# EAGLE schematic bilancia_smart_pezzi_uc (EAGLE 7.3.0)
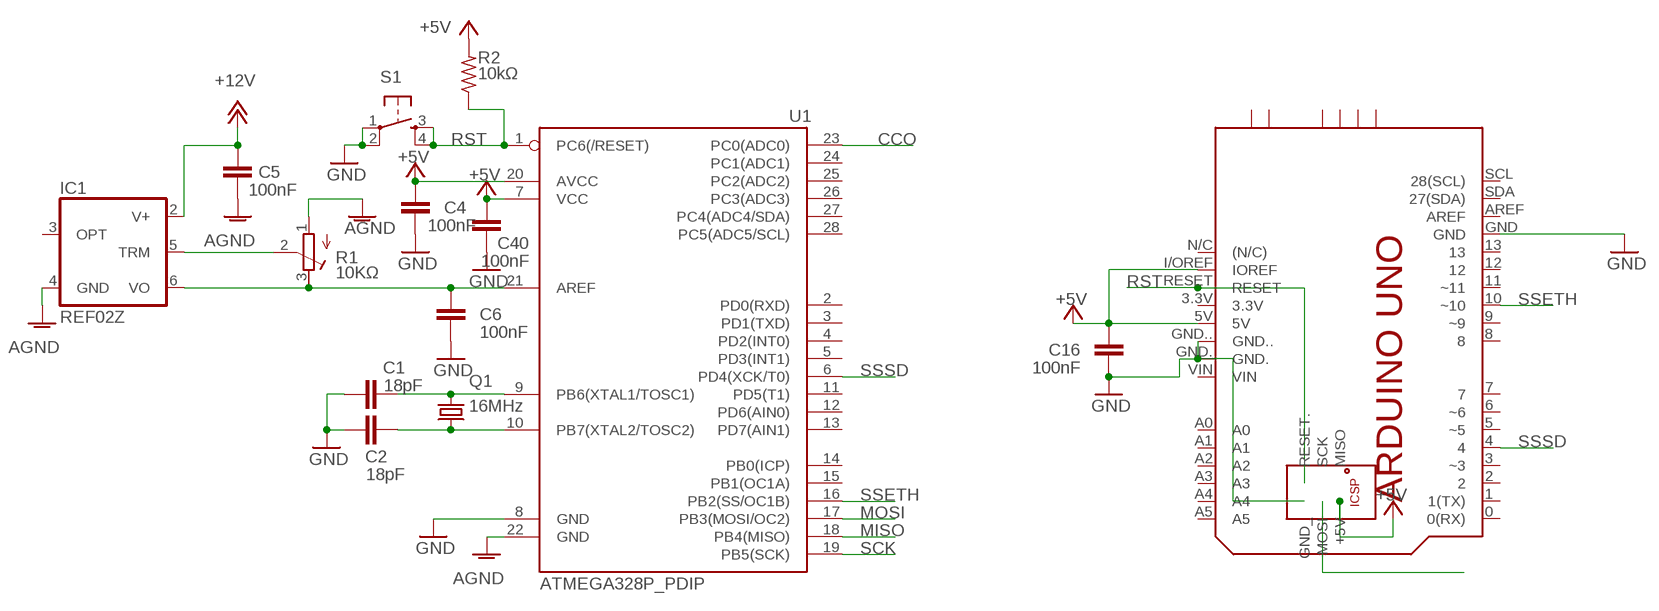
[diagram p0: schematic, sheet 1]

## Parts
C1  18pF  C2.5/2  [C2.5-2]
C2  18pF  C2.5/2  [C2.5-2]
C4  100nF  C2.5/2  [C2.5-2]
C5  100nF  C2.5/2  [C2.5-2]
C6  100nF  C2.5/2  [C2.5-2]
C16  100nF  C2.5/2  [C2.5-2]
C40  100nF  C2.5/2  [C2.5-2]
IC1  REF02Z  [DIL08]
PCB1  ARDUINO_UNO  [ARDUINO_UNO]
Q1  16MHz  CRYSTALHC49S  [HC49/S]
R1  10KΩ  R-TRIMM64W  [RTRIM64W]
R2  10kΩ  R-US_0207/10  [0207/10]
S1  TAC_SWITCHPTH  [TACTILE-PTH]
U1  ATMEGA328P_PDIP  [DIL28-3]

## Nets
+5V [massa]: C4.2 C16.2 C40.2 PCB1.5V PCB1.+5V PCB1.I/OREF(IOREF) R2.2 U1.7(VCC) U1.20(AVCC)
+12V [massa]: C5.1 IC1.2(V+)
AGND [massa]: C5.2 IC1.4(GND) R1.1(E) U1.22(GND)
CCO: U1.23(PC0(ADC0))
GND [massa]: C1.1 C2.1 C4.1 C6.1 C16.1 C40.1 PCB1.GND PCB1.GND. PCB1.GND.. PCB1.GND_ S1.1 S1.2 U1.8(GND)
MISO: U1.18(PB4(MISO))
MOSI: PCB1.MOSI U1.17(PB3(MOSI/OC2))
N$1: C6.2 IC1.6(VO) R1.3(A) U1.21(AREF)
N$2: C2.2 Q1.2 U1.10(PB7(XTAL2/TOSC2))
N$3: C1.2 Q1.1 U1.9(PB6(XTAL1/TOSC1))
N$5: IC1.5(TRM) R1.2(S)
RST: PCB1.RESET PCB1.RESET. R2.1 S1.3 S1.4 U1.1(PC6(/RESET))
SCK: U1.19(PB5(SCK))
SSETH: PCB1.10(~10) U1.16(PB2(SS/OC1B))
SSSD: PCB1.4 U1.6(PD4(XCK/T0))
Unconnected: IC1.3(OPT) PCB1.0(0(RX)) PCB1.1(1(TX)) PCB1.2 PCB1.3(~3) PCB1.3.3V PCB1.5(~5) PCB1.6(~6) PCB1.7 PCB1.8 PCB1.9(~9) PCB1.11(~11) PCB1.12 PCB1.13 PCB1.<PWR>+V PCB1.<PWR>-V PCB1.<USB>+V PCB1.<USB>D+ PCB1.<USB>D- PCB1.<USB>GND PCB1.A0 PCB1.A1 PCB1.A2 PCB1.A3 PCB1.A4 PCB1.A5 PCB1.AREF PCB1.MISO PCB1.N/C((N/C)) PCB1.SCK PCB1.SCL(28(SCL)) PCB1.SDA(27(SDA)) PCB1.VIN U1.2(PD0(RXD)) U1.3(PD1(TXD)) U1.4(PD2(INT0)) U1.5(PD3(INT1)) U1.11(PD5(T1)) U1.12(PD6(AIN0)) U1.13(PD7(AIN1)) U1.14(PB0(ICP)) U1.15(PB1(OC1A)) U1.24(PC1(ADC1)) U1.25(PC2(ADC2)) U1.26(PC3(ADC3)) U1.27(PC4(ADC4/SDA)) U1.28(PC5(ADC5/SCL))

## Library data of the parts
C1 C2 C4-C6 C16 C40 = capacitor-wima:C: CAPACITOR naming: grid - package width
IC1 = linear:REF02: VOLTAGE REFERENCE
PCB1 = E14_Arduino:ARDUINO_UNO: Device for representing an Arduino Uno board with a footprint in an EAGLE design. Created by Dave Young for Element14. More EAGLE documentation at: http://www.element14.com/community/community/knode/cadsoft_eagle
Q1 = adafruit:CRYSTAL: CRYSTAL; OC_FARNELL: 1667008; OC_NEWARK: unknown
R1 = resistor:R-TRIMM: Trimm resistor
R2 = resistor:R-US_: RESISTOR, American symbol
S1 = SparkFun-Electromechanical:TAC_SWITCH: Momentary Switch Button commonly used for reset or general input. Spark Fun Electronics SKU : COM-00097 SMT- SWCH-08247
U1 = SparkFun-DigitalIC:ATMEGA328P_PDIP: uC used in the Arduino 32kb flash, 1k EEPROM, 2k SRAM This is the through-hole version of this chip.

## Net classes
0 default: clearance 0.205 mm
1 massa: width 0.5 mm, clearance 0.205 mm